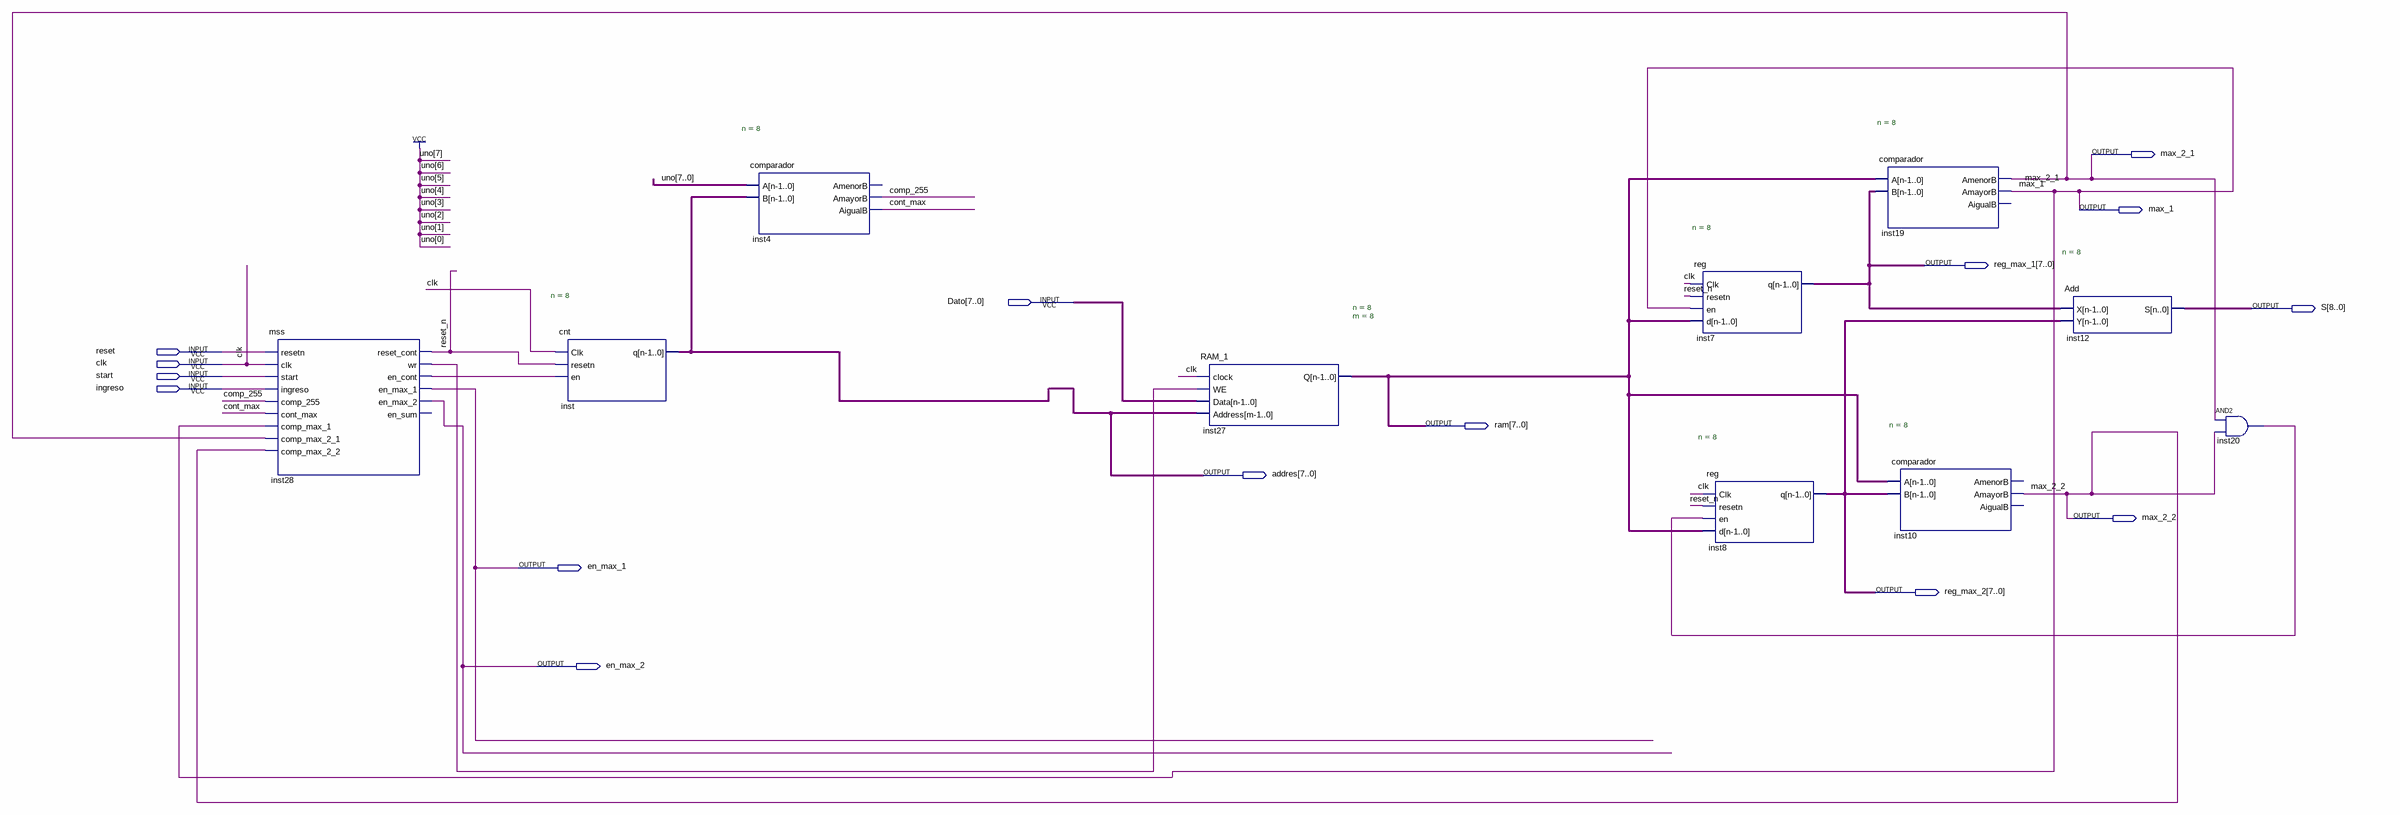
[diagram p0: schematic sheet]
// Quartus schematic proyecto.bdf as structural Verilog: 10 symbols, 15 pins
module proyecto (
  input  [7:0] Dato,
  input  reset,
  input  clk,
  input  start,
  input  ingreso,
  output max_2_1,
  output max_1,
  output [7:0] reg_max_1,
  output [8:0] S,
  output [7:0] ram,
  output [7:0] addres,
  output max_2_2,
  output en_max_1,
  output [7:0] reg_max_2,
  output en_max_2
);

  wire comp_255, cont_max, inst20_out, inst28_en_cont, inst28_wr, reset_n;

  mss inst28 (
    .resetn(reset), .clk(clk), .start(start), .ingreso(ingreso), .comp_255(comp_255), .cont_max(cont_max),
    .comp_max_1(max_1), .comp_max_2_1(max_2_1), .comp_max_2_2(max_2_2), .reset_cont(reset_n), .wr(inst28_wr),
    .en_cont(inst28_en_cont), .en_max_1(en_max_1), .en_max_2(en_max_2));  // open: en_sum
  cnt #(.n(8)) inst (.Clk(clk), .resetn(reset_n), .en(inst28_en_cont), .q(addres));
  comparador #(.n(8)) inst4 (.A({8{1'b1}}), .B(addres), .AmayorB(comp_255), .AigualB(cont_max));  // open: AmenorB
  RAM_1 #(.n(8), .m(8)) inst27 (.clock(clk), .WE(inst28_wr), .Data(Dato), .Address(addres), .Q(ram));
  \reg  #(.n(8)) inst7 (.Clk(clk), .resetn(reset_n), .en(max_1), .d(ram), .q(reg_max_1));
  \reg  #(.n(8)) inst8 (.Clk(clk), .resetn(reset_n), .en(inst20_out), .d(ram), .q(reg_max_2));
  comparador #(.n(8)) inst19 (.A(ram), .B(reg_max_1), .AmenorB(max_2_1), .AmayorB(max_1));  // open: AigualB
  comparador #(.n(8)) inst10 (.A(ram), .B(reg_max_2), .AmayorB(max_2_2));  // open: AmenorB, AigualB
  Add #(.n(8)) inst12 (.X(reg_max_1), .Y(reg_max_2), .S(S));
  and inst20 (inst20_out, max_2_1, max_2_2);
endmodule
